# Altium schematic sheet 08_Misc_3.SchDoc: Power
size A3; Organization: Lime Microsystems; Address1: Surrey Tech Centre; Address2: Guildford GU2 7YG; Address3: Surrey; Address4: United Kingdom; Revision: v1.1; SheetNumber: 12; SheetTotal: 12
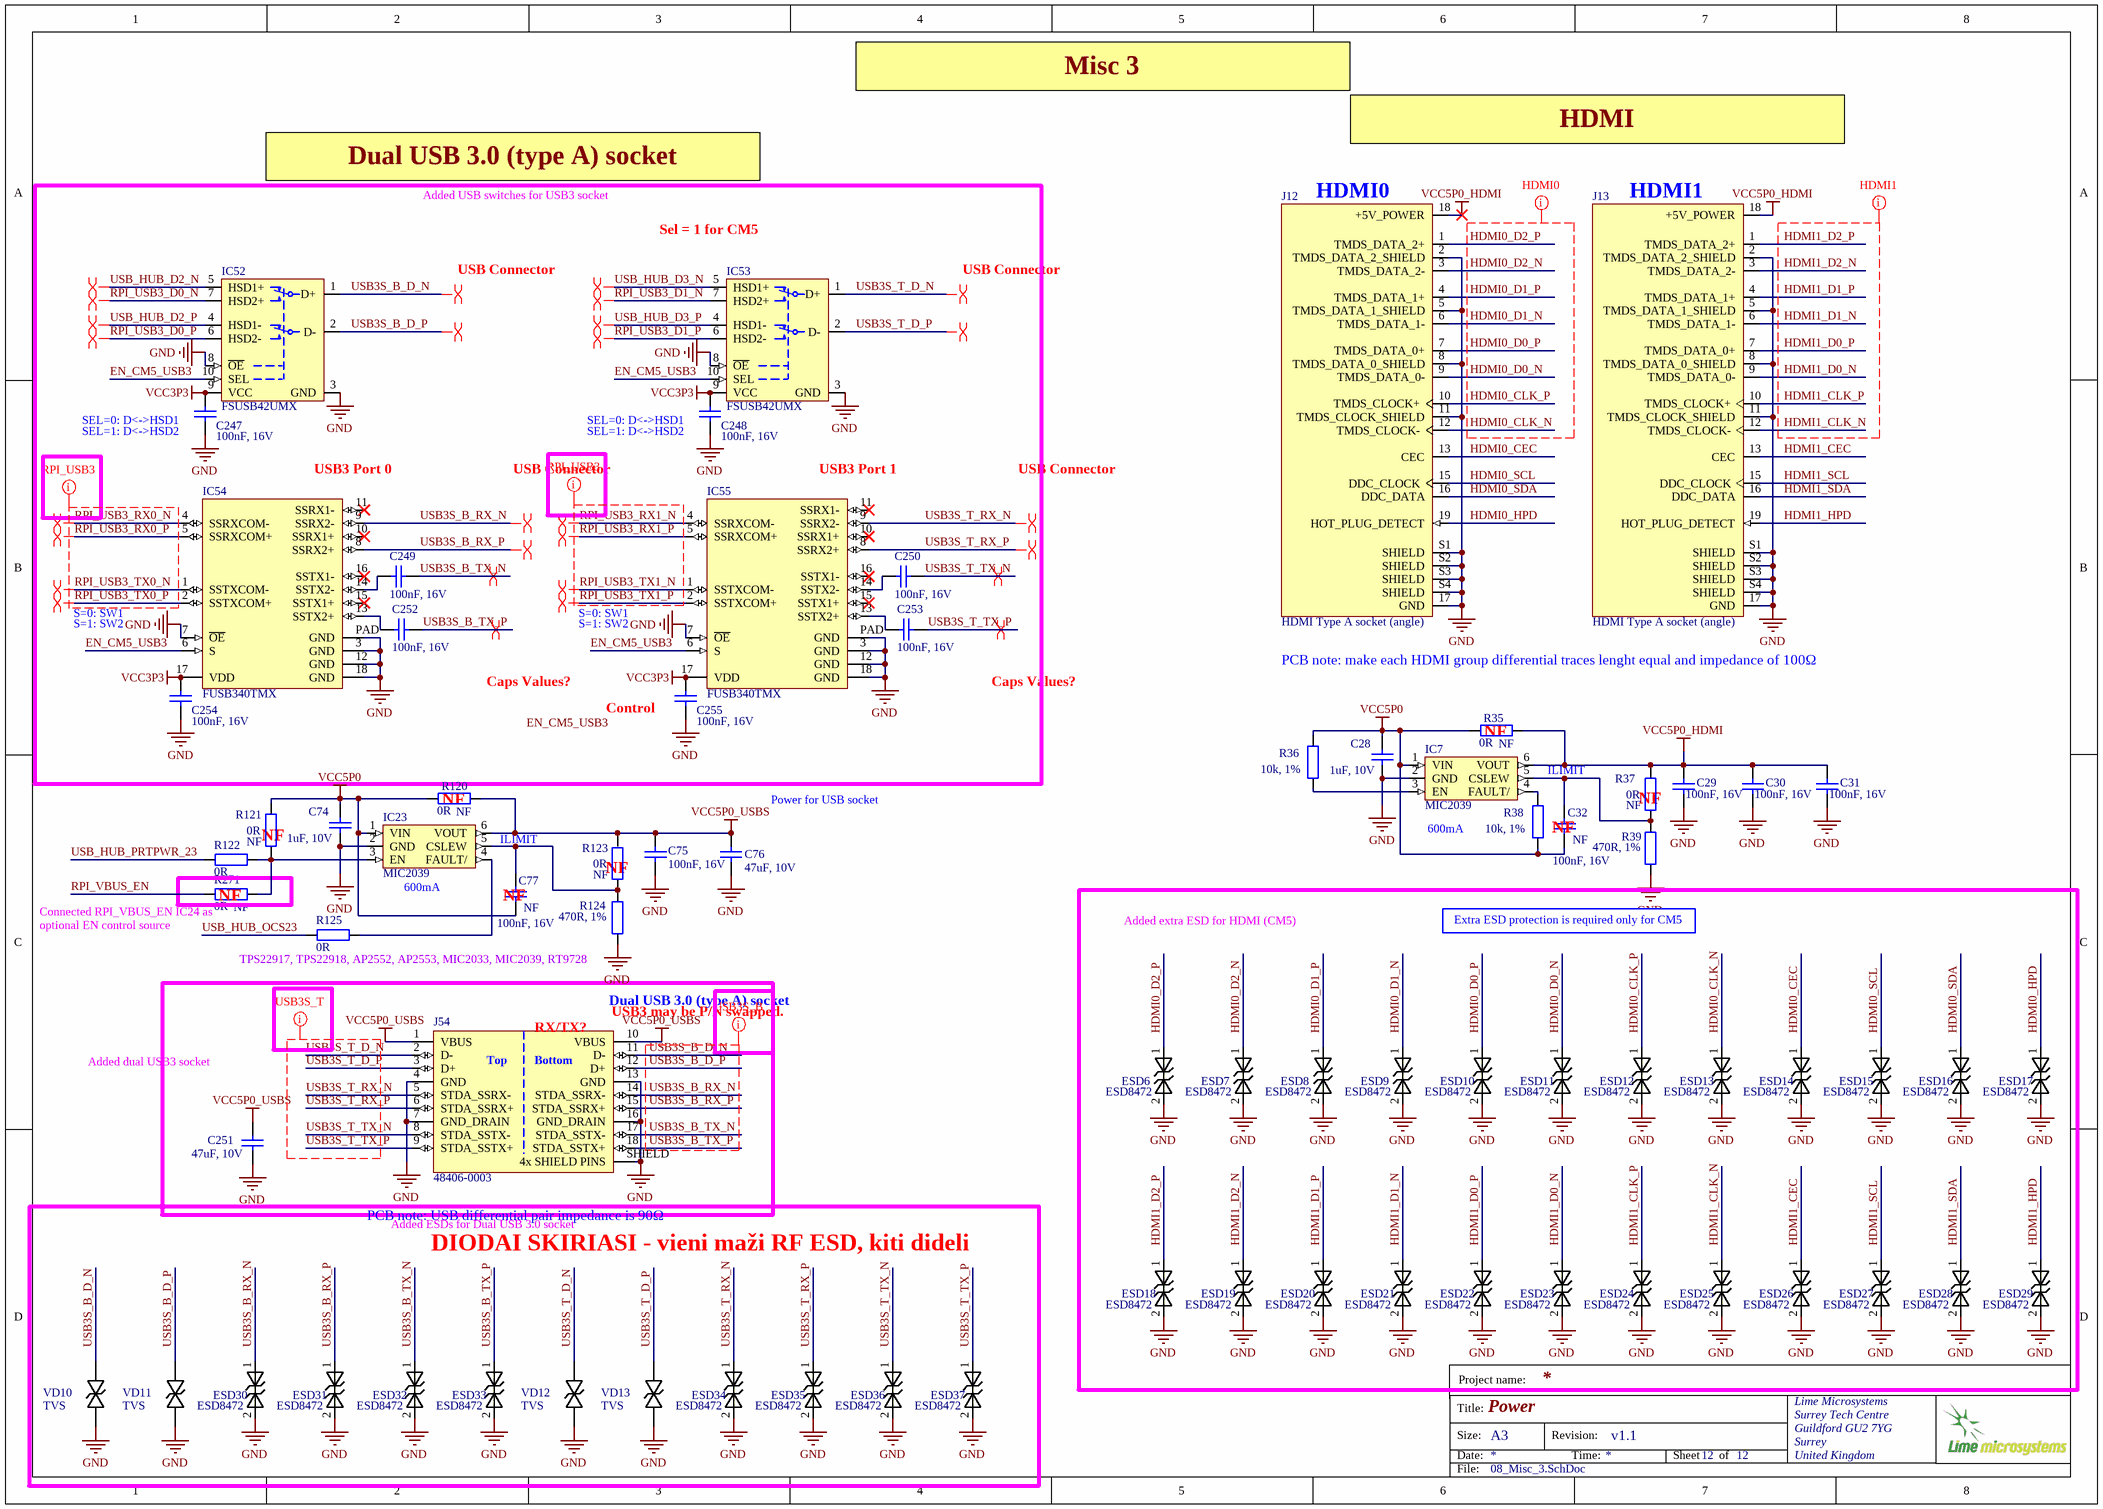
[diagram p0: 08_Misc_3.SchDoc]

## Parts
C28  1uF, 10V  [CAP0402]
C29  100nF, 16V  [CAP0402]
C30  100nF, 16V  [CAP0402]
C31  100nF, 16V  [CAP0402]
C32  100nF, 16V  Assembly Info: NF  [CAP0402]
C74  1uF, 10V  [CAP0402]
C75  100nF, 16V  [CAP0402]
C76  47uF, 10V  [CAP1206]
C77  100nF, 16V  Assembly Info: NF  [CAP0402]
C247  100nF, 16V  [CAP0402]
C248  100nF, 16V  [CAP0402]
C249  100nF, 16V  [CAP0402]
C250  100nF, 16V  [CAP0402]
C251  47uF, 10V  [CAP1206]
C252  100nF, 16V  [CAP0402]
C253  100nF, 16V  [CAP0402]
C254  100nF, 16V  [CAP0402]
C255  100nF, 16V  [CAP0402]
ESD6  ESD8472  [ESD8472_X3DFN2]
ESD7  ESD8472  [ESD8472_X3DFN2]
ESD8  ESD8472  [ESD8472_X3DFN2]
ESD9  ESD8472  [ESD8472_X3DFN2]
ESD10  ESD8472  [ESD8472_X3DFN2]
ESD11  ESD8472  [ESD8472_X3DFN2]
ESD12  ESD8472  [ESD8472_X3DFN2]
ESD13  ESD8472  [ESD8472_X3DFN2]
ESD14  ESD8472  [ESD8472_X3DFN2]
ESD15  ESD8472  [ESD8472_X3DFN2]
ESD16  ESD8472  [ESD8472_X3DFN2]
ESD17  ESD8472  [ESD8472_X3DFN2]
ESD18  ESD8472  [ESD8472_X3DFN2]
ESD19  ESD8472  [ESD8472_X3DFN2]
ESD20  ESD8472  [ESD8472_X3DFN2]
ESD21  ESD8472  [ESD8472_X3DFN2]
ESD22  ESD8472  [ESD8472_X3DFN2]
ESD23  ESD8472  [ESD8472_X3DFN2]
ESD24  ESD8472  [ESD8472_X3DFN2]
ESD25  ESD8472  [ESD8472_X3DFN2]
ESD26  ESD8472  [ESD8472_X3DFN2]
ESD27  ESD8472  [ESD8472_X3DFN2]
ESD28  ESD8472  [ESD8472_X3DFN2]
ESD29  ESD8472  [ESD8472_X3DFN2]
ESD30  ESD8472  [ESD8472_X3DFN2]
ESD31  ESD8472  [ESD8472_X3DFN2]
ESD32  ESD8472  [ESD8472_X3DFN2]
ESD33  ESD8472  [ESD8472_X3DFN2]
ESD34  ESD8472  [ESD8472_X3DFN2]
ESD35  ESD8472  [ESD8472_X3DFN2]
ESD36  ESD8472  [ESD8472_X3DFN2]
ESD37  ESD8472  [ESD8472_X3DFN2]
IC7  MIC2039  [SOT23-6]
IC23  MIC2039  [SOT23-6]
IC52  FSUSB42UMX  [FSUSB42UMX]
IC53  FSUSB42UMX  [FSUSB42UMX]
IC54  FUSB340TMX  [FUSB340TMX_USB_switch_18-XFQFN]
IC55  FUSB340TMX  [FUSB340TMX_USB_switch_18-XFQFN]
J12  HDMI Type A socket (angle)  [HDMI_HD01-19-RA-TH]
J13  HDMI Type A socket (angle)  [HDMI_HD01-19-RA-TH]
J54  48406-0003  [Dual_USB_48406-0003_Molex]
R35  0R  Assembly Info: NF  [RES0402]
R36  10k, 1%  [RES0402]
R37  0R  Assembly Info: NF  [RES0402]
R38  10k, 1%  [RES0402]
R39  470R, 1%  [RES0402]
R120  0R  Assembly Info: NF  [RES0402]
R121  0R  Assembly Info: NF  [RES0402]
R122  0R  [RES0402]
R123  0R  Assembly Info: NF  [RES0402]
R124  470R, 1%  [RES0402]
R125  0R  [RES0402]
R271  0R  Assembly Info: NF  [RES0402]
VD10  TVS  [SOD323]
VD11  TVS  [SOD323]
VD12  TVS  [SOD323]
VD13  TVS  [SOD323]

## Blocks framed on the sheet
PCB note: USB differential pair impedance is 90Ω: ESD30-ESD37 VD10-VD13

## Nets
GND: C28.2 C29.2 C30.2 C31.2 C74.2 C75.2 C76.1 C247.2 C248.2 C251.1 C254.2 C255.2 ESD6.2 ESD7.2 ESD8.2 ESD9.2 ESD10.2 ESD11.2 ESD12.2 ESD13.2 ESD14.2 ESD15.2 ESD16.2 ESD17.2 ESD18.2 ESD19.2 ESD20.2 ESD21.2 ESD22.2 ESD23.2 ESD24.2 ESD25.2 ESD26.2 ESD27.2 ESD28.2 ESD29.2 ESD30.2 ESD31.2 ESD32.2 ESD33.2 ESD34.2 ESD35.2 ESD36.2 ESD37.2 IC7.2(GND) IC23.2(GND) IC52.3(GND) IC52.8(~{OE}) IC53.3(GND) IC53.8(~{OE}) IC54.3(GND) IC54.7(~{OE}) IC54.12(GND) IC54.18(GND) IC54.PAD(GND) IC55.3(GND) IC55.7(~{OE}) IC55.12(GND) IC55.18(GND) IC55.PAD(GND) J12.2(TMDS_DATA_2_SHIELD) J12.5(TMDS_DATA_1_SHIELD) J12.8(TMDS_DATA_0_SHIELD) J12.11(TMDS_CLOCK_SHIELD) J12.17(GND) J12.S1(SHIELD) J12.S2(SHIELD) J12.S3(SHIELD) J12.S4(SHIELD) J13.2(TMDS_DATA_2_SHIELD) J13.5(TMDS_DATA_1_SHIELD) J13.8(TMDS_DATA_0_SHIELD) J13.11(TMDS_CLOCK_SHIELD) J13.17(GND) J13.S1(SHIELD) J13.S2(SHIELD) J13.S3(SHIELD) J13.S4(SHIELD) J54.4(GND) J54.7(GND_DRAIN) J54.13(GND) J54.16(GND_DRAIN) J54.SHIELD(4x_SHIELD_PINS) R39.1 R124.1 VD10.K VD11.K VD12.K VD13.K
VCC3P3: C247.1 C248.1 C254.1 C255.1 IC52.9(VCC) IC53.9(VCC) IC54.17(VDD) IC55.17(VDD)
VCC5P0: C28.1 C32.2 C74.1 C77.2 IC7.1(VIN) IC23.1(VIN) R35.2 R36.2 R38.1 R120.2 R121.2
VCC5P0_HDMI: C29.1 C30.1 C31.1 IC7.6(VOUT) J12.18(+5V_POWER) J13.18(+5V_POWER) R35.1 R37.2
VCC5P0_USBS: C75.1 C76.2 C251.2 IC23.6(VOUT) J54.1(VBUS) J54.10(VBUS) R120.1 R123.2
EN_CM5_USB3: IC52.10(SEL) IC53.10(SEL) IC54.6(S) IC55.6(S)
HDMI0_CEC: ESD14.1 J12.13(CEC)
HDMI0_CLK_N: ESD13.1 J12.12(TMDS_CLOCK-)
HDMI0_CLK_P: ESD12.1 J12.10(TMDS_CLOCK+)
HDMI0_D0_N: ESD11.1 J12.9(TMDS_DATA_0-)
HDMI0_D0_P: ESD10.1 J12.7(TMDS_DATA_0+)
HDMI0_D1_N: ESD9.1 J12.6(TMDS_DATA_1-)
HDMI0_D1_P: ESD8.1 J12.4(TMDS_DATA_1+)
HDMI0_D2_N: ESD7.1 J12.3(TMDS_DATA_2-)
HDMI0_D2_P: ESD6.1 J12.1(TMDS_DATA_2+)
HDMI0_HPD: ESD17.1 J12.19(HOT_PLUG_DETECT)
HDMI0_SCL: ESD15.1 J12.15(DDC_CLOCK)
HDMI0_SDA: ESD16.1 J12.16(DDC_DATA)
HDMI1_CEC: ESD26.1 J13.13(CEC)
HDMI1_CLK_N: ESD25.1 J13.12(TMDS_CLOCK-)
HDMI1_CLK_P: ESD24.1 J13.10(TMDS_CLOCK+)
HDMI1_D0_N: ESD23.1 J13.9(TMDS_DATA_0-)
HDMI1_D0_P: ESD22.1 J13.7(TMDS_DATA_0+)
HDMI1_D1_N: ESD21.1 J13.6(TMDS_DATA_1-)
HDMI1_D1_P: ESD20.1 J13.4(TMDS_DATA_1+)
HDMI1_D2_N: ESD19.1 J13.3(TMDS_DATA_2-)
HDMI1_D2_P: ESD18.1 J13.1(TMDS_DATA_2+)
HDMI1_HPD: ESD29.1 J13.19(HOT_PLUG_DETECT)
HDMI1_SCL: ESD27.1 J13.15(DDC_CLOCK)
HDMI1_SDA: ESD28.1 J13.16(DDC_DATA)
RPI_USB3_D0_N: IC52.7(HSD2+)
RPI_USB3_D0_P: IC52.6(HSD2-)
RPI_USB3_D1_N: IC53.7(HSD2+)
RPI_USB3_D1_P: IC53.6(HSD2-)
RPI_USB3_RX0_N: IC54.4(SSRXCOM-)
RPI_USB3_RX0_P: IC54.5(SSRXCOM+)
RPI_USB3_RX1_N: IC55.4(SSRXCOM-)
RPI_USB3_RX1_P: IC55.5(SSRXCOM+)
RPI_USB3_TX0_N: IC54.1(SSTXCOM-)
RPI_USB3_TX0_P: IC54.2(SSTXCOM+)
RPI_USB3_TX1_N: IC55.1(SSTXCOM-)
RPI_USB3_TX1_P: IC55.2(SSTXCOM+)
RPI_VBUS_EN: R271.2
USB3S_B_D_N: IC52.1(D+) J54.11(D-) VD10.A
USB3S_B_D_P: IC52.2(D-) J54.12(D+) VD11.A
USB3S_B_RX_N: ESD30.1 IC54.9(SSRX2-) J54.14(STDA_SSRX-)
USB3S_B_RX_P: ESD31.1 IC54.8(SSRX2+) J54.15(STDA_SSRX+)
USB3S_B_TX_N: C249.2 ESD32.1 J54.17(STDA_SSTX-)
USB3S_B_TX_P: C252.2 ESD33.1 J54.18(STDA_SSTX+)
USB3S_T_D_N: IC53.1(D+) J54.2(D-) VD12.A
USB3S_T_D_P: IC53.2(D-) J54.3(D+) VD13.A
USB3S_T_RX_N: ESD34.1 IC55.9(SSRX2-) J54.5(STDA_SSRX-)
USB3S_T_RX_P: ESD35.1 IC55.8(SSRX2+) J54.6(STDA_SSRX+)
USB3S_T_TX_N: C250.2 ESD36.1 J54.8(STDA_SSTX-)
USB3S_T_TX_P: C253.2 ESD37.1 J54.9(STDA_SSTX+)
USB_HUB_D2_N: IC52.5(HSD1+)
USB_HUB_D2_P: IC52.4(HSD1-)
USB_HUB_D3_N: IC53.5(HSD1+)
USB_HUB_D3_P: IC53.4(HSD1-)
USB_HUB_OCS23: R125.2
USB_HUB_PRTPWR_23: R122.2
NetC32_1: C32.1 IC7.5(CSLEW) R37.1 R39.2
NetC77_1: C77.1 IC23.5(CSLEW) R123.1 R124.2
NetC249_1: C249.1 IC54.14(SSTX2-)
NetC250_1: C250.1 IC55.14(SSTX2-)
NetC252_1: C252.1 IC54.13(SSTX2+)
NetC253_1: C253.1 IC55.13(SSTX2+)
NetIC7_3: IC7.3(EN) R36.1
NetIC7_4: IC7.4(FAULT/) R38.2
NetIC23_3: IC23.3(EN) R121.1 R122.1 R271.1
NetIC23_4: IC23.4(FAULT/) R125.1

Not connected (* = marked no-connect by the designer): IC54 10(SSRX1+)* 11(SSRX1-)* 15(SSTX1+)* 16(SSTX1-)*; IC55 10(SSRX1+)* 11(SSRX1-)* 15(SSTX1+)* 16(SSTX1-)*

## Layout directives
differential pair: RPI_USB3_D0_N, RPI_USB3_D0_P, RPI_USB3_D1_N, RPI_USB3_D1_P, RPI_USB3_RX0_N, RPI_USB3_RX0_P, RPI_USB3_RX1_N, RPI_USB3_RX1_P, RPI_USB3_TX0_N, RPI_USB3_TX0_P, RPI_USB3_TX1_N, RPI_USB3_TX1_P, USB3S_B_D_N, USB3S_B_D_P, USB3S_B_RX_N, USB3S_B_RX_P, USB3S_B_TX_N, USB3S_B_TX_P, USB3S_T_D_N, USB3S_T_D_P, USB3S_T_RX_N, USB3S_T_RX_P, USB3S_T_TX_N, USB3S_T_TX_P, USB_HUB_D2_N, USB_HUB_D2_P, USB_HUB_D3_N, USB_HUB_D3_P
net class RPI_USB3: RPI_USB3_RX0_N, RPI_USB3_RX0_P, RPI_USB3_RX1_N, RPI_USB3_RX1_P, RPI_USB3_TX0_N, RPI_USB3_TX0_P, RPI_USB3_TX1_N, RPI_USB3_TX1_P
net class USB3S_T: USB3S_T_D_N, USB3S_T_D_P, USB3S_T_RX_N, USB3S_T_RX_P, USB3S_T_TX_N, USB3S_T_TX_P
net class USB3S_B: USB3S_B_D_N, USB3S_B_D_P, USB3S_B_RX_N, USB3S_B_RX_P, USB3S_B_TX_N, USB3S_B_TX_P
net class HDMI0: HDMI0_CLK_N, HDMI0_CLK_P, HDMI0_D0_N, HDMI0_D0_P, HDMI0_D1_N, HDMI0_D1_P, HDMI0_D2_N, HDMI0_D2_P
net class HDMI1: HDMI1_CLK_N, HDMI1_CLK_P, HDMI1_D0_N, HDMI1_D0_P, HDMI1_D1_N, HDMI1_D1_P, HDMI1_D2_N, HDMI1_D2_P

## Notes on the sheet
- Misc 3
- Dual USB 3.0 (type A) socket
- HDMI
- Added USB switches for USB3 socket
- Sel = 1 for CM5
- HDMI0
- HDMI1
- (near IC52) USB Connector
- (near IC53) USB Connector
- (near C247) SEL=0: D<->HSD1
- (near C247) SEL=1: D<->HSD2
- (near C248) SEL=0: D<->HSD1
- (near C248) SEL=1: D<->HSD2
- USB3 Port 0
- USB Connector
- USB3 Port 1
- S=0: SW1
- S=1: SW2
- Caps Values?
- Control
- PCB note: make each HDMI group differential traces lenght equal and impedance of 100Ω
- (near R35) NF
- ILIMIT
- (near R121) NF
- (near R120) NF
- Power for USB socket
- (near IC7) 600mA
- NF
- (near R37) NF
- (near R271) NF
- (near IC23) 600mA
- (near C77) NF
- (near R123) NF
- (near R271) Connected RPI_VBUS_EN IC24 as optional EN control source
- TPS22917, TPS22918, AP2552, AP2553, MIC2033, MIC2039, RT9728
- Added extra ESD for HDMI (CM5)
- (near R39) Extra ESD protection is required only for CM5
- (near J54) RX/TX?
- (near J54) Dual USB 3.0 (type A) socket
- (near J54) USB3 may be P/N swapped.
- (near J54) Added dual USB3 socket
- (near J54) Added ESDs for Dual USB 3.0 socket
- DIODAI SKIRIASI - vieni maži RF ESD, kiti dideli
- Labels drawn without touching a wire or pin: EN_CM5_USB3
- Project name:
- Title:
- Size:
- Date:
- A3
- Revision:
- Time:
- Sheet
- of
- File:
- (in symbol Dual_USB_48406-0003_Molex) Top; Bottom

## Library data of the parts
C28 C74 = Cap_0402: Manufacturer Part Number 1: CC0402MRX5R6BB105; Manufacturer: Yageo; Part Description: 1µF 10V Ceramic Capacitor X5R 0402 (1005 Metric) 0.039" L x 0.020" W (1.00mm x 0.50mm); Voltage Rating: 10; Capacitance Tolerance: ± 10%; Product Range: TDK - C Series; Ceramic Capacitor Case: 0402 [1005 Metric]; Capacitance: 1; Dielectric Characteristic: X6; Value: 1uF, 10V; Supplier 1: Digi-Key; Supplier Part Number 1: 311-1732-1-ND; MSL: -; RoHS: YES
C29-C32 C75 C77 = Cap_0402: Manufacturer: Murata Electronics; Manufacturer Part Number 1: GRM155R71C104KA88D; Part Description: 0.10µF ±10% 16V Ceramic Capacitor X7R 0402 (1005 Metric); Tolerance: 10 %; Type: General Purpose MLCC; Capacitance: 0.1 uF; Case Length: 1 mm; Dielectric: X7R; Case Height: 0.5 mm; Temperature Coefficient / Code: +/- 15 %; Value: 100nF, 16V; Supplier 1: Mouser; Supplier Part Number 1: 81-GRM155R71C104KA88; Case Code - in: 0402; RoHS: RoHS Compliant; Operating Temperature Range: - 55 C to + 125 C; Series: GRM; Termination Style: SMD/SMT; Package / Case: 0402 (1005 metric); Voltage Rating DC: 16 V; Maximum Operating Temperature: + 125 C; Case Code - mm: 1005; Minimum Operating Temperature: - 55 C; Product Category: Low & Medium Capacitance SMD Ceramic Chip Capacitors; Packaging: Reel; Product: General Type MLCCs; Category: Multilayer Ceramic Capacitors MLCC - SMD/SMT; Brand: Murata Electronics; Case Width: 0.5 mm; RoHS - Mouser: Y; Standard Pack Qty: 10000; Minimum Order Quantity: 1; Reeling: True; Manufacturer Part Number: GRM155R71C104KA88D
C76 C251 = Cap_1206: Manufacturer: TDK Corporation; Manufacturer Part Number 1: C3216X6S1A476M160AC; Part Description: 47µF ±20% 10V Ceramic Capacitor X6S 1206 (3216 Metric); Notification: Current market demand for these product types have resulted in fluctuating and extending lead times. Lead times may differ.; Tolerance: ±20%; Temperature Coefficient: X6S; Value: 47uF, 10V; RoHS: RoHS Compliant; Packaging: Cut Tape (CT); Operating Temperature: -55°C ~ 105°C; Voltage - Rated: 10V; Height - Seated (Max): -; Ratings: -; Applications: General Purpose; Features: Low ESL; Size / Dimension: 0.126" L x 0.063" W (3.20mm x 1.60mm); Supplier 1: Digi-Key; Lead Spacing: -; Supplier Part Number 1: 445-6010-1-ND; Thickness (Max): 0.071" (1.80mm); Failure Rate: -; Category: Capacitors; Lead Style: -; Part Status: Active; Mounting Type: Surface Mount, MLCC; Package / Case: 1206 (3216 Metric)
C247-C250 C252-C255 = Cap_0402: Manufacturer: Murata Electronics; Manufacturer Part Number: GRM155R71C104KA88D; Part Description: 0.10µF ±10% 16V Ceramic Capacitor X7R 0402 (1005 Metric); Tolerance: 10 %; Type: General Purpose MLCC; Capacitance: 0.1 uF; Case Length: 1 mm; Dielectric: X7R; Case Height: 0.5 mm; Temperature Coefficient / Code: +/- 15 %; Value: 100nF, 16V; Supplier 1: Mouser; Supplier Part Number 1: 81-GRM155R71C104KA88; Case Code - in: 0402; RoHS: RoHS Compliant; Operating Temperature Range: - 55 C to + 125 C; Series: GRM; Termination Style: SMD/SMT; Package / Case: 0402 (1005 metric); Voltage Rating DC: 16 V; Maximum Operating Temperature: + 125 C; Case Code - mm: 1005; Minimum Operating Temperature: - 55 C; Product Category: Low & Medium Capacitance SMD Ceramic Chip Capacitors; Packaging: Reel; Product: General Type MLCCs; Category: Multilayer Ceramic Capacitors MLCC - SMD/SMT; Brand: Murata Electronics; Case Width: 0.5 mm; RoHS - Mouser: Y; Standard Pack Qty: 10000; Minimum Order Quantity: 1; Reeling: True; Manufacturer Part Number 1: GRM155R71C104KA88D
ESD6-ESD37 = ESD8472: Manufacturer: ON Semiconductor; Manufacturer Part Number 1: ESD8472MUT5G; Part Description: TVS DIODE 5.3VWM 14VC X3DFN2; Voltage - Reverse Standoff (Typ): 5.3V (Max); Voltage - Breakdown (Min): 7V; Voltage - Clamping (Max) @ Ipp: 14V; Current - Peak Pulse (10/1000µs): 3A (8/20µs); Power Line Protection: No; Capacitance @ Frequency: 0.2pF @ 1MHz; Supplier 1: Digi-Key; RoHS: RoHS Compliant; Category: Circuit Protection; Stock 1: 2295; Pricing 1: 1=0.39, 10=0.315, 100=0.2142, 500=0.16068, 1000=0.12051 (USD); Packaging: Cut Tape (CT); Part Status: Active; Type: Zener; Power - Peak Pulse: -; Applications: Automotive, RF Antenna; Operating Temperature: -55°C ~ 150°C (TJ); Mounting Type: Surface Mount; Package / Case: 2-XFDFN; Supplier Device Package: 2-X3DFN (0.62x0.32); ComponentLink1URL: http://www.onsemi.com/pub/Collateral/ESD8472-D.PDF; ComponentLink1Description: http://www.onsemi.com/pub/Collateral/ESD8472-D.PDF; Supplier Part Number 1: ESD8472MUT5GOSCT-ND
IC7 IC23 = MIC2033_power_switch: Part Description: Power Switch/Driver 1:1 P-Channel 2.5A SOT-23-6; Manufacturer: Microchip; Manufacturer Part Number 1: MIC2039EYM6-TR; Number of Outputs: 1; Interface: On/Off; Max Output Current: 2.5A; Fault Protection: Over Temperature; Output Configuration: High Side; ComponentLink1URL: http://www.mouser.com/ds/2/268/mic2033-b-1076865.pdf?src-supplier=Mouser; ComponentLink1Description: http://www.mouser.com/ds/2/268/mic2033-b-1076865.pdf?src-supplier=Mouser; ComponentLink2URL: http://components.arrow.com/part/dataview/56727820S413982N1374?src-supplier=Arrow+Electronics; ComponentLink2Description: http://components.arrow.com/part/dataview/56727820S413982N1374?src-supplier=Arrow+Electronics; ComponentLink3URL: http://www.microchip.com/mymicrochip/filehandler.aspx?ddocname=en579457&src-supplier=Digi-Key; ComponentLink3Description: http://www.microchip.com/mymicrochip/filehandler.aspx?ddocname=en579457&src-supplier=Digi-Key; Supplier 1: Digi-Key; Supplier Part Number 1: 576-4193-1-ND; Stock 1: 37195; Pricing 1: 1=0,98000, 25=0,80560, 100=0,75000 (USD); RoHS: No; Case/Package: SOT-23-6; Min Operating Temperature: -40°C; Max Operating Temperature: 125°C; Package Quantity: 3000; Packaging: Tape and Reel; Series: -; ComponentLink4URL: https://datasheet.ciiva.com/6607/mic2039-6607725.pdf?src-supplier=Digi-Key; ComponentLink4Description: https://datasheet.ciiva.com/6607/mic2039-6607725.pdf?src-supplier=Digi-Key
IC52 IC53 = FSUSB42UMX: Part Description: USB Switch IC 1 Channel 10-UMLP (1.8x1.4); Manufacturer: ON Semiconductor; Switch Circuit: DPDT; On-State Resistance (Max): 6.5 Ohm; Voltage - Supply, Single (V+): 2.4 V ~ 4.4 V; -3db Bandwidth: 720MHz; Supplier 1: Digi-Key; Manufacturer Part Number 1: FSUSB42UMX; RoHS: RoHS Compliant; Category: Integrated Circuits (ICs); Stock 1: 8344; Pricing 1: 1=0.59, 10=0.502, 100=0.3749, 500=0.29458, 1000=0.22763 (USD); Packaging: Cut Tape (CT); Part Status: Active; Applications: USB; Multiplexer/Demultiplexer Circuit: -; Voltage - Supply, Dual (V±): -; Features: Break-Before-Make, USB 2.0; Operating Temperature: -40°C ~ 85°C (TA); Package / Case: 10-UFQFN; Supplier Device Package: 10-UMLP (1.8x1.4); Base Part Number: FSUSB42; ComponentLink1URL: https://www.fairchildsemi.com/datasheets/FS/FSUSB42.pdf; ComponentLink1Description: https://www.fairchildsemi.com/datasheets/FS/FSUSB42.pdf; Supplier Part Number 1: FSUSB42UMXCT-ND
IC54 IC55 = FUSB340TMX_USB_switch: Part Description: USB Switch USB 3.1 USB Interface 18-TMLP (2x2.8); Manufacturer: ON Semiconductor / Fairchild; Interface: USB; Operating Supply Current: 12uA; Number of Switches: 4; Data Rate: 10Gbps; Max Supply Voltage: 5V; Min Supply Voltage: 1.5V; Supplier 1: Digikey; Supplier Part Number 1: FUSB340TMXCT-ND; Manufacturer Part Number 1: FUSB340TMX; Stock 1: 7942; Pricing 1: 1=1,15, 10=1,026, 25=0,9744, 100=0,7481, 250=0,66108, 500=0,6263, 1000=0,48712, 2500=0,46277 (USD); RoHS: Yes; Mount: Surface Mount; Number of Pins: 18; Weight: 0.0065g; Min Operating Temperature: -40°C; Max Operating Temperature: 85°C; Packaging: Cut Tape; Series: -; Nominal Supply Current: 12uA; Height: 400um; RoHS Compliant: Yes; ComponentLink1URL: http://www.farnell.com/datasheets/2313412.pdf?src-supplier=Farnell; ComponentLink1Description: http://www.farnell.com/datasheets/2313412.pdf?src-supplier=Farnell; ComponentLink2URL: http://www.farnell.com/datasheets/2313412.pdf?src-supplier=Newark; ComponentLink2Description: http://www.farnell.com/datasheets/2313412.pdf?src-supplier=Newark; ComponentLink3URL: https://datasheet.octopart.com/FUSB340TMX-ON-Semiconductor-datasheet-85553255.pdf?src-supplier=Farnell; ComponentLink3Description: https://datasheet.octopart.com/FUSB340TMX-ON-Semiconductor-datasheet-85553255.pdf?src-supplier=Farnell; ComponentLink4URL: https://datasheet.octopart.com/FUSB340TMX-ON-Semiconductor-datasheet-46935021.pdf?src-supplier=Future+Electronics; ComponentLink4Description: https://datasheet.octopart.com/FUSB340TMX-ON-Semiconductor-datasheet-46935021.pdf?src-supplier=Future+Electronics; ComponentLink5URL: https://www.fairchildsemi.com/Assets/-Featured-Collateral/Datasheet-Briefs/FUSB340_PB_Final.pdf?src-supplier=Avnet; ComponentLink5Description: https://www.fairchildsemi.com/Assets/-Featured-Collateral/Datasheet-Briefs/FUSB340_PB_Final.pdf?src-supplier=Avnet
J12 J13 = HDMI_HD01-19-RA-TH: Manufacturer: CUI Devices; Part Description: HDMI HDMI 2.1 Receptacle Connector 19 Position Through Hole, Right Angle; Supplier 1: Digi-Key; Supplier Part Number 1: 2223-HD01-19-RA-TH-ND; Manufacturer Part Number 1: HD01-19-RA-TH; Stock 1: 2182; Pricing 1: 1=2,15000, 10=1,87000, 25=1,79080, 70=1,75100, 140=1,67136, 280=1,51221, 490=1,39282, 980=1,19385, 2450=1,11426 (USD); RoHS: No
J54 = Dual_USB_48406-0003_Molex: Part Description: USB Connectors USB 3.0 F/A STD RA REC STACKED 15u'; Manufacturer: Molex; Manufacturer Part Number 1: 0484060003; Supplier 1: Mouser; Supplier Part Number 1: 538-48406-0003; Stock 1: 4086; Pricing 1: 1=2,69, 10=1,92, 50=1,92, 100=1,82, 1000=1,78, 10000=1,43 (USD); RoHS: Yes; ComponentLink1URL: https://datasheet.octopart.com/48406-0003-Molex-datasheet-33003502.pdf?src-supplier=Newark; ComponentLink1Description: https://datasheet.octopart.com/48406-0003-Molex-datasheet-33003502.pdf?src-supplier=Newark; ComponentLink2URL: https://datasheet.octopart.com/48406-0003-Molex-datasheet-101583044.pdf?src-supplier=Farnell; ComponentLink2Description: https://datasheet.octopart.com/48406-0003-Molex-datasheet-101583044.pdf?src-supplier=Farnell; ComponentLink3URL: https://www.molex.com/pdm_docs/sd/484060003_sd.pdf?src-supplier=Digikey; ComponentLink3Description: https://www.molex.com/pdm_docs/sd/484060003_sd.pdf?src-supplier=Digikey; ComponentLink4URL: https://datasheet.octopart.com/484060003-Molex-datasheet-168216735.pdf?src-supplier=TME; ComponentLink4Description: https://datasheet.octopart.com/484060003-Molex-datasheet-168216735.pdf?src-supplier=TME; ComponentLink5URL: https://datasheet.octopart.com/48406-0003-Molex-datasheet-21137617.pdf?src-supplier=Sager+Electronics; ComponentLink5Description: https://datasheet.octopart.com/48406-0003-Molex-datasheet-21137617.pdf?src-supplier=Sager+Electronics; ComponentLink6URL: https://datasheet.octopart.com/48406-0003-Molex-datasheet-154752298.pdf?src-supplier=Master+Electronics; ComponentLink6Description: https://datasheet.octopart.com/48406-0003-Molex-datasheet-154752298.pdf?src-supplier=Master+Electronics
R35 R37 R120-R123 R125 R271 = Res_0402: Manufacturer Part Number 1: RC0402JR-070RL; Manufacturer: Yageo; Part Description: RES SMD 0.0OHM JUMPER 1/16W 0402; Resistance (Ohms): 0.0; Tolerance: Jumper; Power (Watts): 0.063W, 1/16W; Value: 0R; Supplier 1: Digi-Key; Supplier Part Number 1: 311-0.0JRTR-ND; Category: Resistors; Temperature Coefficient: -; Features: Moisture Resistant; Supplier Device Package: 0402; Height: 0.016" (0.40mm); Package / Case: 0402 (1005 Metric); Operating Temperature: -55°C ~ 155°C; Size / Dimension: 0.039" L x 0.020" W (1.00mm x 0.50mm); Composition: Thick Film; Packaging: Tape & Reel (TR); Number of Terminations: 2; RoHS: RoHS Compliant
R36 R38 = Res_0402: Manufacturer: Yageo; Manufacturer Part Number 1: RC0402FR-0710KL; Part Description: RES SMD 10K OHM 1% 1/16W 0402; Temperature Coefficient: ±100ppm/°C; Power (Watts): 0.063W, 1/16W; Value: 10k, 1%; Supplier 1: Digi-Key; Supplier Part Number 1: 311-10.0KLRTR-ND; Resistance (Ohms): 10k; Packaging: Tape & Reel (TR); RoHS: RoHS Compliant; Package / Case: 0402 (1005 Metric); Tolerance: ±1%; Operating Temperature: -55°C ~ 155°C; Size / Dimension: 0.039" L x 0.020" W (1.00mm x 0.50mm); Number of Terminations: 2; Category: Resistors; Height: 0.016" (0.40mm); Supplier Device Package: 0402; Features: Moisture Resistant; Composition: Thick Film
R39 R124 = Res_0402: Manufacturer 1: Yageo; Manufacturer Part Number 1: RC0402FR-07470RL; Part Description: 470 Ohms ±1% 0.063W, 1/16W Chip Resistor 0402 (1005 Metric) Moisture Resistant Thick Film; Power Rating: 62.5mW; Temperature Coefficient: 100ppm/°C; Voltage Rating: 50V; Max Power Dissipation: 63mW; Value: 470R, 1%; Supplier 1: Digi-Key; Supplier Part Number 1: 311-470LRCT-ND; Stock 1: 1652476; Pricing 1: 1=0,10000, 10=0,01600, 100=0,00660, 1000=0,00299, 2500=0,00259, 5000=0,00214 (USD); RoHS: Yes; Case/Package: 0402; Case Code (Metric): 1005; Case Code (Imperial): 0402; Size Code: 0402; Min Operating Temperature: -55°C; Max Operating Temperature: 155°C; Packaging: Tape and Reel; Tolerance: 1%; Resistance: 470R; Number of Terminations: 2; Features: Moisture Resistant; Package Quantity: 1; Resistor Type: Thick Film; Termination: SMD/SMT; Series: RC; Resistance Tolerance: 1%; Construction: Rectangular; Length: 1mm; Width: 0.02inch; Height: 0.016inch; Depth: 0.5mm; Lead Free: Lead Free; REACH SVHC: Unknown; Military Standard: Not; RoHS Compliant: Yes; Manufacturer: Yageo
VD10-VD13 = DIODE_TVS: Manufacturer 1: Sangdest Microelectronics; Manufacturer Part Number: SD03LCC; Part Description: 19V Clamp 20A (8/20µs) Ipp Tvs Diode Surface Mount SOD-323; ComponentLink1URL: https://datasheet.ciiva.com/29588/littelfuse-tvs-diode-array-sp4020-datasheet-pdf-29588193.pdf?src-supplier=Digi-Key; ComponentLink1Description: https://datasheet.ciiva.com/29588/littelfuse-tvs-diode-array-sp4020-datasheet-pdf-29588193.pdf?src-supplier=Digi-Key; ComponentLink2URL: https://datasheet.ciiva.com/24111/littelfuse-sp4020-267385-24111169.pdf?src-supplier=Mouser; ComponentLink2Description: https://datasheet.ciiva.com/24111/littelfuse-sp4020-267385-24111169.pdf?src-supplier=Mouser; Supplier 1: Digi-Key; Supplier Part Number 1: 1655-SD03LCCCT-ND; Stock 1: 8808; Pricing 1: 1=0,37000, 10=0,27300, 100=0,15460, 500=0,10240, 1000=0,07851 (USD); RoHS: No; Manufacturer: Sangdest Microelectronics; Manufacturer Part Number 1: SD03LCC